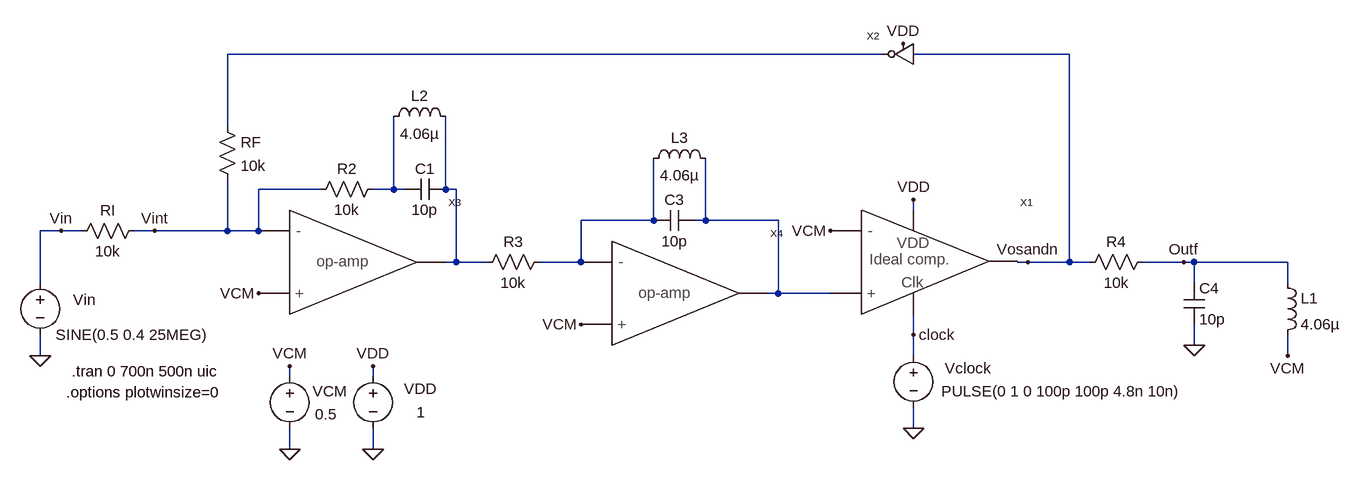
[diagram p0: schematic _Fig8_8a_MSD.asc]
_Fig8_8a_MSD.asc, the LTspice schematic file:
Version 4
SHEET 1 1740 680
WIRE 880 -256 -128 -256
WIRE 1168 -256 928 -256
WIRE -128 -144 -128 -256
WIRE 16 -48 -80 -48
WIRE 128 -48 128 -160
WIRE 128 -48 96 -48
WIRE 144 -48 128 -48
WIRE 208 -48 208 -160
WIRE 224 -48 208 -48
WIRE 928 -16 928 -32
WIRE 528 0 528 -96
WIRE 528 0 416 0
WIRE 608 0 608 -96
WIRE 608 0 592 0
WIRE 720 0 608 0
WIRE -384 16 -416 16
WIRE -352 16 -384 16
WIRE -240 16 -272 16
WIRE -128 16 -128 -64
WIRE -128 16 -240 16
WIRE -80 16 -80 -48
WIRE -80 16 -128 16
WIRE 224 64 224 -48
WIRE 224 64 208 64
WIRE 272 64 224 64
WIRE 416 64 416 0
WIRE 416 64 352 64
WIRE 1104 64 1088 64
WIRE 1168 64 1168 -256
WIRE 1168 64 1104 64
WIRE 1200 64 1168 64
WIRE 1344 64 1280 64
WIRE 1360 64 1344 64
WIRE 1504 64 1360 64
WIRE -416 96 -416 16
WIRE 1360 96 1360 64
WIRE 1504 96 1504 64
WIRE 720 112 720 0
WIRE 720 112 704 112
WIRE 800 112 720 112
WIRE 928 176 928 144
WIRE 1360 192 1360 160
WIRE -416 208 -416 176
WIRE 928 208 928 176
WIRE 1504 208 1504 176
WIRE -32 240 -32 224
WIRE 96 240 96 224
WIRE 928 320 928 288
WIRE -32 352 -32 320
WIRE 96 352 96 320
FLAG 96 352 0
FLAG 928 -32 VDD
FLAG 96 224 VDD
FLAG 928 320 0
FLAG 928 176 clock
FLAG -32 352 0
FLAG -32 224 VCM
FLAG 1104 64 Vosandn
FLAG -416 208 0
FLAG -384 16 Vin
FLAG -240 16 Vint
FLAG 800 16 VCM
FLAG 912 -272 VDD
FLAG -80 112 VCM
FLAG 416 160 VCM
FLAG 1360 192 0
FLAG 1344 64 Outf
FLAG 1504 208 VCM
SYMBOL Ideal_clocked_comparator 848 64 R0
SYMATTR InstName X1
SYMBOL voltage 96 224 R0
WINDOW 0 48 35 Left 0
WINDOW 3 67 71 Left 0
SYMATTR InstName VDD
SYMATTR Value 1
SYMBOL voltage 928 192 R0
WINDOW 0 48 35 Left 0
WINDOW 3 43 71 Left 0
WINDOW 123 0 0 Left 0
WINDOW 39 0 0 Left 0
SYMATTR InstName Vclock
SYMATTR Value PULSE(0 1 0 100p 100p 4.8n 10n)
SYMBOL voltage -32 224 R0
WINDOW 0 35 39 Left 0
WINDOW 3 39 74 Left 0
SYMATTR InstName VCM
SYMATTR Value 0.5
SYMBOL cap 144 -32 R270
WINDOW 0 32 32 VTop 0
WINDOW 3 0 32 VBottom 0
SYMATTR InstName C1
SYMATTR Value 10p
SYMBOL res -256 0 R90
WINDOW 0 0 56 VBottom 0
WINDOW 3 32 56 VTop 0
SYMATTR InstName RI
SYMATTR Value 10k
SYMBOL res -144 -160 R0
SYMATTR InstName RF
SYMATTR Value 10k
SYMBOL voltage -416 80 R0
WINDOW 0 51 42 Left 0
WINDOW 123 0 0 Left 0
WINDOW 39 0 0 Left 0
SYMATTR InstName Vin
SYMATTR Value SINE(0.5 0.4 25MEG)
SYMBOL inverter 928 -256 M0
SYMATTR InstName X2
SYMBOL op_amp -32 64 R0
SYMATTR InstName X3
SYMBOL cap 528 16 R270
WINDOW 0 32 32 VTop 0
WINDOW 3 0 32 VBottom 0
SYMATTR InstName C3
SYMATTR Value 10p
SYMBOL op_amp 464 112 R0
SYMATTR InstName X4
SYMBOL res 256 80 R270
WINDOW 0 32 56 VTop 0
WINDOW 3 0 56 VBottom 0
SYMATTR InstName R3
SYMATTR Value 10k
SYMBOL res 0 -32 R270
WINDOW 0 32 56 VTop 0
WINDOW 3 0 56 VBottom 0
SYMATTR InstName R2
SYMATTR Value 10k
SYMBOL res 1296 48 R90
WINDOW 0 0 56 VBottom 0
WINDOW 3 32 56 VTop 0
SYMATTR InstName R4
SYMATTR Value 10k
SYMBOL cap 1344 96 R0
SYMATTR InstName C4
SYMATTR Value 10p
SYMBOL ind 1488 80 R0
SYMATTR InstName L1
SYMATTR Value 4.06µ
SYMBOL ind 512 -80 R270
WINDOW 0 32 56 VTop 0
WINDOW 3 5 56 VBottom 0
SYMATTR InstName L3
SYMATTR Value 4.06µ
SYMBOL ind 112 -144 R270
WINDOW 0 32 56 VTop 0
WINDOW 3 5 56 VBottom 0
SYMATTR InstName L2
SYMATTR Value 4.06µ
TEXT -368 232 Left 0 !.tran 0 700n 500n uic
TEXT -376 264 Left 0 !.options plotwinsize=0

The netlist it stands for:
* _Fig8_8a_MSD.asc
XX1 VCM N005 Vosandn VDD clock Ideal_clocked_comparator  ; pins Vinm Vinp Vout VDD Clock
VDD VDD 0 1
Vclock clock 0 PULSE(0 1 0 100p 100p 4.8n 10n)
VCM VCM 0 0.5
C1 N002 N003 10p
RI Vint Vin 10k
RF N001 Vint 10k
Vin Vin 0 SINE(0.5 0.4 25MEG)
XX2 Vosandn N001 VDD inverter  ; pins In Out VDD
XX3 Vint VCM N003 op_amp  ; pins Vinm Vinp Out
C3 N004 N005 10p
XX4 N004 VCM N005 op_amp  ; pins Vinm Vinp Out
R3 N003 N004 10k
R2 Vint N002 10k
R4 Outf Vosandn 10k
C4 Outf 0 10p
L1 Outf VCM 4.06µ
L3 N004 N005 4.06µ
L2 N002 N003 4.06µ
.tran 0 700n 500n uic
.options plotwinsize=0
.backanno
.end